# EasyEDA schematic startracker.json
TITLE: Sheet_1; REV: 1.0; Date: 2023-02-17; Sheet: 1/1; Company: Your Company
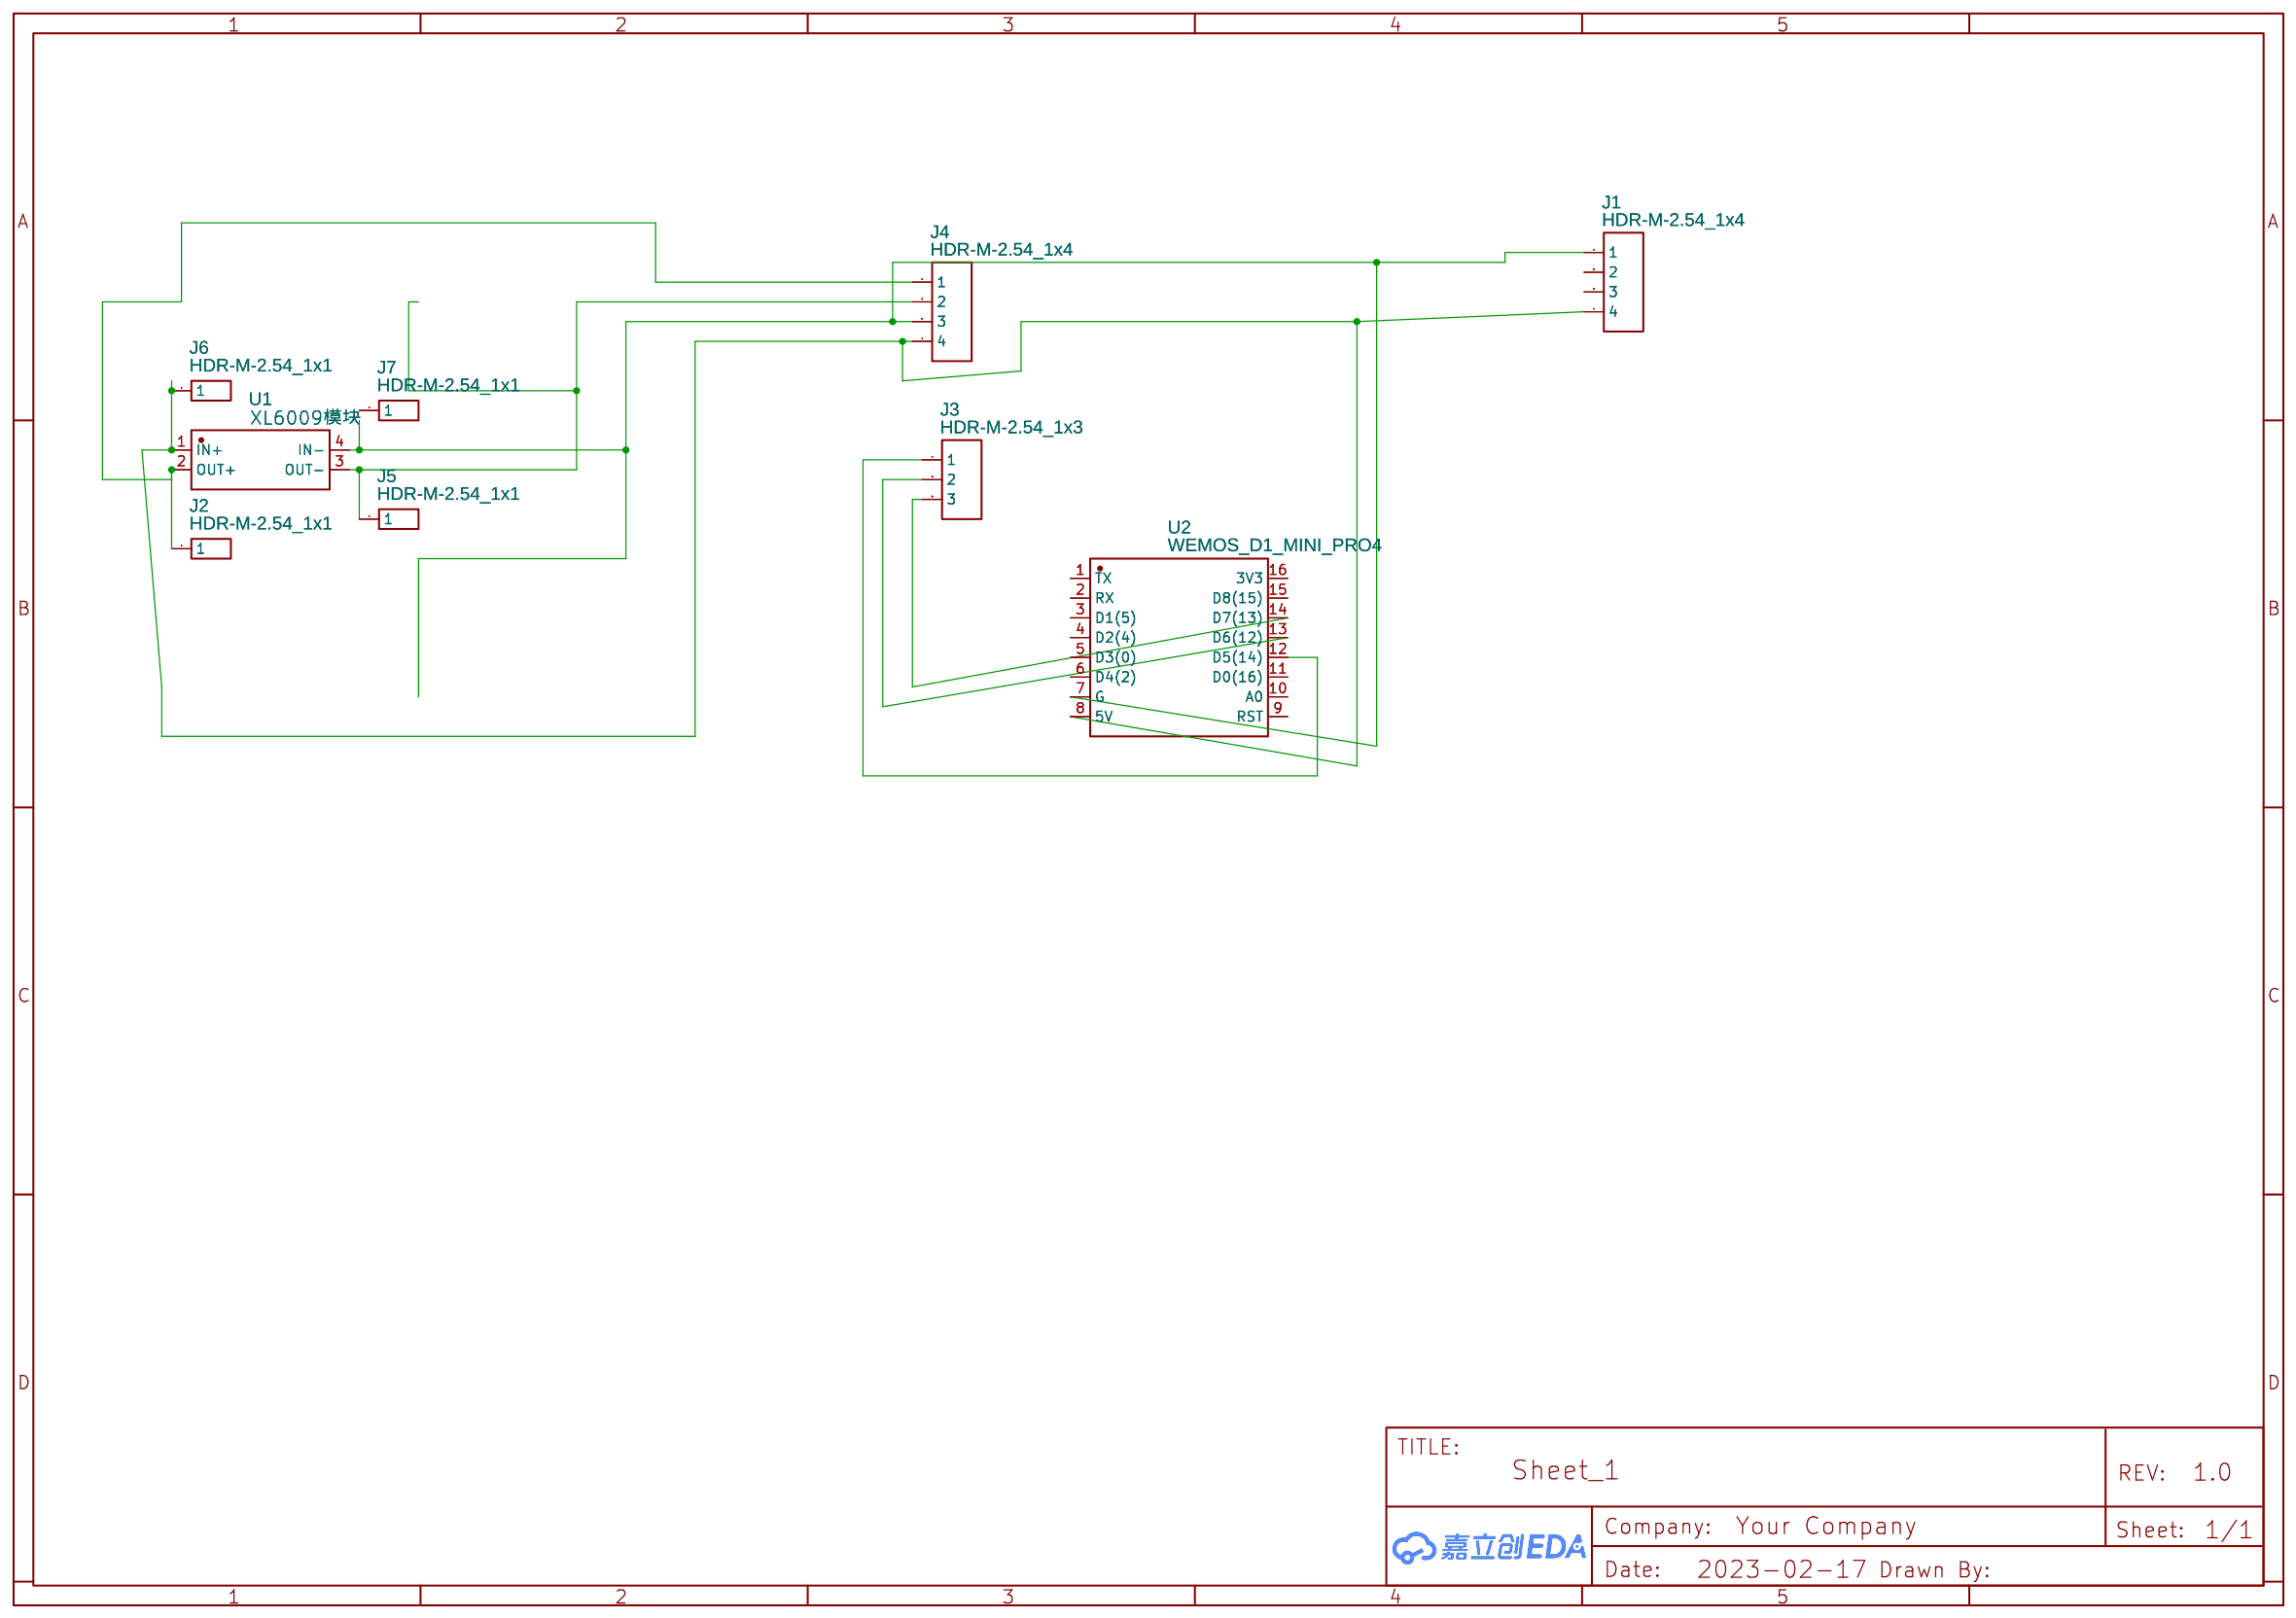
[diagram p0: schematic sheet]

## Parts
J1  HDR-M-2.54_1x4  [HDR-M-2.54_1X4]
J2  HDR-M-2.54_1x1  [HDR-M-2.54_1X1]
J3  HDR-M-2.54_1x3  [HDR-M-2.54_1X3]
J4  HDR-M-2.54_1x4  [HDR-M-2.54_1X4]
J5  HDR-M-2.54_1x1  [HDR-M-2.54_1X1]
J6  HDR-M-2.54_1x1  [HDR-M-2.54_1X1]
J7  HDR-M-2.54_1x1  [HDR-M-2.54_1X1]
U1  XL6009模块  [XFMR-SMD_XL6009]
U2  WEMOS_D1_MINI_PRO4  [DIP-16_WEMOS_D1_MINI_PRO4]

## Library data of the parts
J1 J4 = HDR-M-2.54_1x4: Supplier Part: C124378; Supplier: LCSC; Contributor: LCEDA_Lib
J2 J5-J7 = HDR-M-2.54_1x1: Supplier Part: C81276; Supplier: LCSC; Contributor: LCEDA_Lib
J3 = HDR-M-2.54_1x3: Supplier Part: C180248; Supplier: LCSC; Contributor: LCEDA_Lib
U1 = XL6009模块: Supplier: LCSC; Supplier Part: C2908146; Manufacturer: null; Manufacturer Part: xl6009模块; JLCPCB Part Class: Extended Part; Contributor: LCSC
U2 = WEMOS_D1_MINI_PRO4: Supplier: LCSC; Supplier Part: C2837266; Manufacturer: null; Manufacturer Part: Wemos_D1_mini_Pro4; Contributor: LCSC; JLCPCB Part Class: Extended Part

## Nets
Net-(J1-1): J1.1 J4.3 U1.4(IN-) U2.7(G)
Net-(J1-4): J1.4 J4.4 J6.1 U1.1(IN+) U2.8(5V)
Net-(J2-1): J2.1 J4.1 U1.2(OUT+)
Net-(J3-1): J3.1 U2.12(D5(14))
Net-(J3-2): J3.2 U2.13(D6(12))
Net-(J3-3): J3.3 U2.14(D7(13))
Net-(J4-2): J4.2 J5.1 U1.3(OUT-)

Not connected (* = marked no-connect by the designer): J1 2 3; J7 1; U2 1(TX) 2(RX) 3(D1(5)) 4(D2(4)) 5(D3(0)) 6(D4(2)) 9(RST) 10(A0) 11(D0(16)) 15(D8(15)) 16(3V3)
